# EAGLE board modul_frequency (EAGLE 7.7.0)
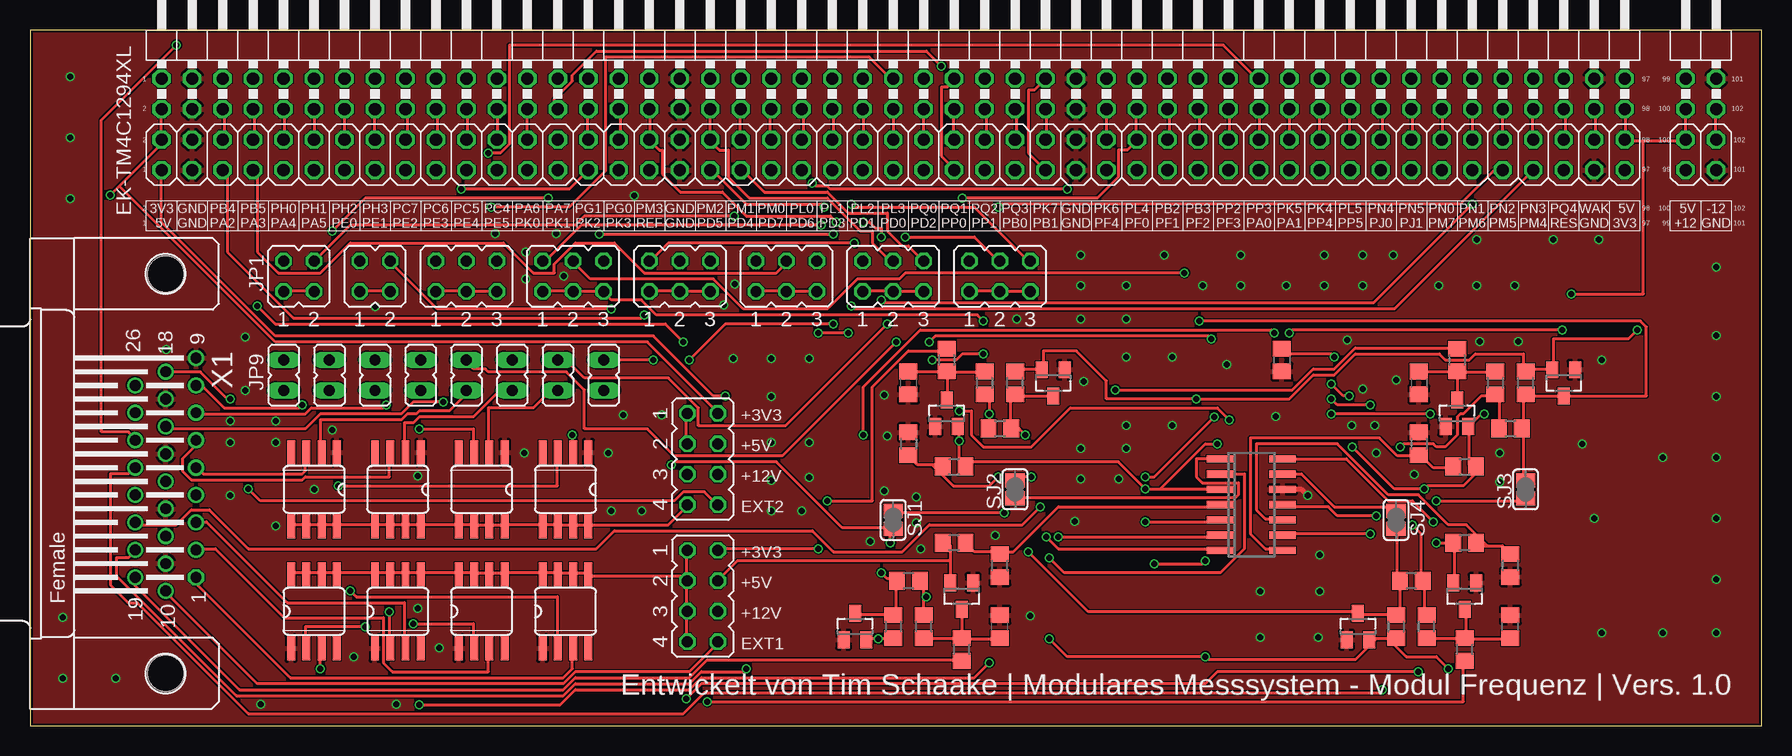
[diagram p5: board, top side]
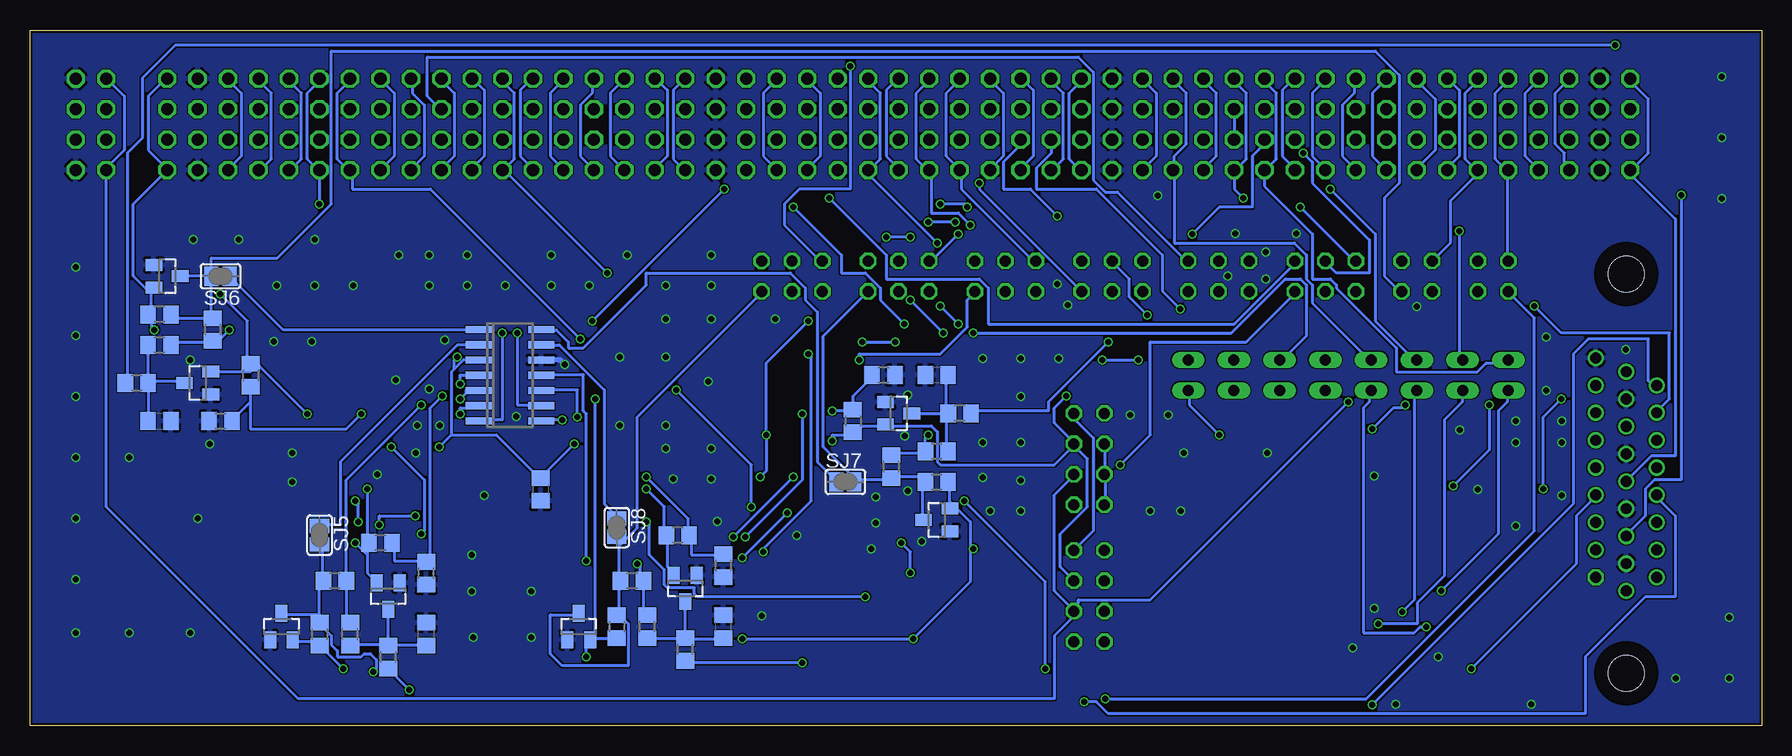
[diagram p6: board, bottom side, seen from below]

Size 144.32 x 58 mm. Coordinates in mm from the lower left corner, seen from the top.
Outline: 0,0 144.32,0 144.32,58 0,58 0,0
Copper layers (1*16): Top 0.018mm / dielectric 1.55mm / Bottom 0.018mm
Design rules "Multi-CB_2L_100µm-Tracks_OL35µm *": minimum track width 0.25mm, minimum drill 0.5mm, track to track 0.1mm, track to pad 0.1mm, pad to pad 0.1mm, via to via 0.1mm, smd to smd 0mil, copper to edge 0.2mm, drill to drill 0.2mm, minimum pad ring 0.125mm, minimum via ring 0.1mm, stop-mask expansion 2mil, vias tented up to drill 0.45mm, thermal gap 0.2mm

## Footprints (pad centres in the part's own frame; a part is rotated, then mirrored left to right if it is on the bottom)
C0805 = smd 1.3 x 1.5: 1 -0.95,0; 2 0.95,0
SOT23 = smd 1 x 1.4: 1 -0.95,-1.1; 2 0.95,-1.1; 3 0,1.1
EK-TM4C1294XL_BB+_NOMARK/90 = drill 1.016 octagon: 1 -60.96,-1.27; 2 -60.96,1.27; 3 -58.42,-1.27; 4 -58.42,1.27; 5 -55.88,-1.27; 6 -55.88,1.27; 7 -53.34,-1.27; 8 -53.34,1.27; 9 -50.8,-1.27; 10 -50.8,1.27; 11 -48.26,-1.27; 12 -48.26,1.27; 13 -45.72,-1.27; 14 -45.72,1.27; 15 -43.18,-1.27; 16 -43.18,1.27; 17 -40.64,-1.27; 18 -40.64,1.27; 19 -38.1,-1.27; 20 -38.1,1.27; 21 -35.56,-1.27; 22 -35.56,1.27; 23 -33.02,-1.27; 24 -33.02,1.27; 25 -30.48,-1.27; 26 -30.48,1.27; 27 -27.94,-1.27; 28 -27.94,1.27; 29 -25.4,-1.27; 30 -25.4,1.27; 31 -22.86,-1.27; 32 -22.86,1.27; 33 -20.32,-1.27; 34 -20.32,1.27; 35 -17.78,-1.27; 36 -17.78,1.27; 37 -15.24,-1.27; 38 -15.24,1.27; 39 -12.7,-1.27; 40 -12.7,1.27; 41 -10.16,-1.27; 42 -10.16,1.27; 43 -7.62,-1.27; 44 -7.62,1.27; 45 -5.08,-1.27; 46 -5.08,1.27; 47 -2.54,-1.27; 48 -2.54,1.27; 49 0,-1.27; 50 0,1.27; 51 2.54,-1.27; 52 2.54,1.27; 53 5.08,-1.27; 54 5.08,1.27; 55 7.62,-1.27; 56 7.62,1.27; 57 10.16,-1.27; 58 10.16,1.27; 59 12.7,-1.27; 60 12.7,1.27; 61 15.24,-1.27; 62 15.24,1.27; 63 17.78,-1.27; 64 17.78,1.27; 65 20.32,-1.27; 66 20.32,1.27; 67 22.86,-1.27; 68 22.86,1.27; 69 25.4,-1.27; 70 25.4,1.27; 71 27.94,-1.27; 72 27.94,1.27; 73 30.48,-1.27; 74 30.48,1.27; 75 33.02,-1.27; 76 33.02,1.27; 77 35.56,-1.27; 78 35.56,1.27; 79 38.1,-1.27; 80 38.1,1.27; 81 40.64,-1.27; 82 40.64,1.27; 83 43.18,-1.27; 84 43.18,1.27; 85 45.72,-1.27; 86 45.72,1.27; 87 48.26,-1.27; 88 48.26,1.27; 89 50.8,-1.27; 90 50.8,1.27; 91 53.34,-1.27; 92 53.34,1.27; 93 55.88,-1.27; 94 55.88,1.27; 95 58.42,-1.27; 96 58.42,1.27; 97 60.96,-1.27; 98 60.96,1.27; 99 66.04,-1.27; 100 66.04,1.27; 101 68.58,-1.27; 102 68.58,1.27
SO14 = smd 0.6 x 2.2: 1 -3.81,-2.6; 2 -2.54,-2.6; 3 -1.27,-2.6; 4 0,-2.6; 5 1.27,-2.6; 6 2.54,-2.6; 7 3.81,-2.6; 8 3.81,2.6; 9 2.54,2.6; 10 1.27,2.6; 11 0,2.6; 12 -1.27,2.6; 13 -2.54,2.6; 14 -3.81,2.6
JP2Q = drill 0.914 octagon: 1 -1.27,-1.27; 2 -1.27,1.27; 3 1.27,-1.27; 4 1.27,1.27
JP3Q = drill 0.914 octagon: 1 -2.54,-1.27; 2 -2.54,1.27; 3 0,-1.27; 4 0,1.27; 5 2.54,-1.27; 6 2.54,1.27
JP1 = drill 0.914 long: 1 0,-1.27; 2 0,1.27
JP4Q = drill 0.914 octagon: 1 -3.81,-1.27; 2 -3.81,1.27; 3 -1.27,-1.27; 4 -1.27,1.27; 5 1.27,-1.27; 6 1.27,1.27; 7 3.81,-1.27; 8 3.81,1.27
EK-TM4C1294XL_BB+ = drill 1.016 octagon: 1 -60.96,-1.27; 2 -60.96,1.27; 3 -58.42,-1.27; 4 -58.42,1.27; 5 -55.88,-1.27; 6 -55.88,1.27; 7 -53.34,-1.27; 8 -53.34,1.27; 9 -50.8,-1.27; 10 -50.8,1.27; 11 -48.26,-1.27; 12 -48.26,1.27; 13 -45.72,-1.27; 14 -45.72,1.27; 15 -43.18,-1.27; 16 -43.18,1.27; 17 -40.64,-1.27; 18 -40.64,1.27; 19 -38.1,-1.27; 20 -38.1,1.27; 21 -35.56,-1.27; 22 -35.56,1.27; 23 -33.02,-1.27; 24 -33.02,1.27; 25 -30.48,-1.27; 26 -30.48,1.27; 27 -27.94,-1.27; 28 -27.94,1.27; 29 -25.4,-1.27; 30 -25.4,1.27; 31 -22.86,-1.27; 32 -22.86,1.27; 33 -20.32,-1.27; 34 -20.32,1.27; 35 -17.78,-1.27; 36 -17.78,1.27; 37 -15.24,-1.27; 38 -15.24,1.27; 39 -12.7,-1.27; 40 -12.7,1.27; 41 -10.16,-1.27; 42 -10.16,1.27; 43 -7.62,-1.27; 44 -7.62,1.27; 45 -5.08,-1.27; 46 -5.08,1.27; 47 -2.54,-1.27; 48 -2.54,1.27; 49 0,-1.27; 50 0,1.27; 51 2.54,-1.27; 52 2.54,1.27; 53 5.08,-1.27; 54 5.08,1.27; 55 7.62,-1.27; 56 7.62,1.27; 57 10.16,-1.27; 58 10.16,1.27; 59 12.7,-1.27; 60 12.7,1.27; 61 15.24,-1.27; 62 15.24,1.27; 63 17.78,-1.27; 64 17.78,1.27; 65 20.32,-1.27; 66 20.32,1.27; 67 22.86,-1.27; 68 22.86,1.27; 69 25.4,-1.27; 70 25.4,1.27; 71 27.94,-1.27; 72 27.94,1.27; 73 30.48,-1.27; 74 30.48,1.27; 75 33.02,-1.27; 76 33.02,1.27; 77 35.56,-1.27; 78 35.56,1.27; 79 38.1,-1.27; 80 38.1,1.27; 81 40.64,-1.27; 82 40.64,1.27; 83 43.18,-1.27; 84 43.18,1.27; 85 45.72,-1.27; 86 45.72,1.27; 87 48.26,-1.27; 88 48.26,1.27; 89 50.8,-1.27; 90 50.8,1.27; 91 53.34,-1.27; 92 53.34,1.27; 93 55.88,-1.27; 94 55.88,1.27; 95 58.42,-1.27; 96 58.42,1.27; 97 60.96,-1.27; 98 60.96,1.27; 99 66.04,-1.27; 100 66.04,1.27; 101 68.58,-1.27; 102 68.58,1.27
R0805 = smd 1.3 x 1.5: 1 -0.95,0; 2 0.95,0
SJ = smd 1.168 x 1.6: 1 -0.762,0; 2 0.762,0
SO08 = smd 0.66 x 2.032: 1 -1.905,-3.073; 2 -0.635,-3.073; 3 0.635,-3.073; 4 1.905,-3.073; 5 1.905,3.073; 6 0.635,3.073; 7 -0.635,3.073; 8 -1.905,3.073
HDF26H = drill 0.9 octagon: 1 8.639,2.54 | drill 0.9: 2 6.353,2.54; 3 4.067,2.54; 4 1.781,2.54; 5 -0.505,2.54; 6 -2.791,2.54; 7 -5.077,2.54; 8 -7.363,2.54; 9 -9.649,2.54; 10 9.782,0; 11 7.496,0; 12 5.21,0; 13 2.924,0; 14 0.638,0; 15 -1.648,0; 16 -3.934,0; 17 -6.22,0; 18 -8.506,0; 19 8.639,-2.54; 20 6.353,-2.54; 21 4.067,-2.54; 22 1.781,-2.54; 23 -0.505,-2.54; 24 -2.791,-2.54; 25 -5.077,-2.54; 26 -7.363,-2.54 | hole 3: -16.65,0; 16.65,0

## Placement (x,y rotation side)
C1  10p  [C0805]  73.2,28.57 270 top
C2  10p  [C0805]  115.75,28.57 270 top
C3  10p  [C0805]  123.37,8.26 90 top
C4  10p  [C0805]  80.82,8.26 90 top
C5  100n  [C0805]  104.31,30.48 270 top
C6  10p  [C0805]  111.3,7.62 90 bottom
C7  10p  [C0805]  133.53,25.4 0 bottom
C8  10p  [C0805]  68.75,29.21 180 bottom
C9  10p  [C0805]  86.53,8.26 90 bottom
C10  100n  [C0805]  101.78,19.68 270 bottom
D1  BAT54S  [SOT23]  85.27,28.57 180 top
D2  BAT54S  [SOT23]  76.38,26.04 0 top
D3  BAT54S  [SOT23]  127.81,28.57 180 top
D4  BAT54S  [SOT23]  118.92,26.04 0 top
D5  BAT54S  [SOT23]  110.67,8.26 0 top
D6  BAT54S  [SOT23]  119.56,10.79 180 top
D7  BAT54S  [SOT23]  68.75,8.26 0 top
D8  BAT54S  [SOT23]  77.64,10.79 180 top
D9  BAT54S  [SOT23]  123.37,8.26 0 bottom
D10  BAT54S  [SOT23]  114.48,10.79 180 bottom
D11  BAT54S  [SOT23]  132.89,37.47 270 bottom
D12  BAT54S  [SOT23]  130.35,28.57 90 bottom
D13  BAT54S  [SOT23]  68.75,17.14 90 bottom
D14  BAT54S  [SOT23]  71.93,26.04 270 bottom
D15  BAT54S  [SOT23]  98.6,8.26 0 bottom
D16  BAT54S  [SOT23]  89.71,11.43 180 bottom
EK-TM4C1294XL  EK-TM4C1294XL_BB+_NOMARK/90  [EK-TM4C1294XL_BB+_NOMARK/90]  71.93,52.67 0 top
IC1  LM339D  [SO14]  101.78,18.41 270 top
IC2  LM339D  [SO14]  104.31,29.21 270 bottom
JP1  [JP2Q]  22.4,37.47 0 top
JP2  [JP2Q]  28.75,37.47 0 top
JP3  [JP3Q]  36.37,37.47 0 top
JP4  [JP3Q]  45.26,37.47 0 top
JP5  [JP3Q]  54.15,37.47 0 top
JP6  [JP3Q]  63.04,37.47 0 top
JP7  [JP3Q]  71.93,37.47 0 top
JP8  [JP3Q]  80.82,37.47 0 top
JP9  [JP1]  21.13,29.21 0 top
JP10  [JP1]  24.94,29.21 0 top
JP11  [JP1]  28.75,29.21 0 top
JP12  [JP1]  32.56,29.21 0 top
JP13  [JP1]  36.37,29.21 0 top
JP14  [JP1]  40.18,29.21 0 top
JP15  [JP1]  43.99,29.21 0 top
JP16  [JP1]  47.8,29.21 0 top
JP17  [JP4Q]  56.05,10.79 270 top
JP18  [JP4Q]  56.05,22.23 270 top
JP_EK-TM4C1294XL  EK-TM4C1294XL_BB+  [EK-TM4C1294XL_BB+]  71.93,47.59 0 top
R1  15k915  [R0805]  76.38,30.48 270 top
R2  271k666  [R0805]  80.82,24.77 0 top
R3  23k952  [R0805]  77.01,21.59 0 top
R4  10k  [R0805]  73.2,23.5 270 top
R5  84k085  [R0805]  79.55,28.57 270 top
R6  10k  [R0805]  82.09,28.57 90 top
R7  15k915  [R0805]  118.92,30.48 270 top
R8  271k666  [R0805]  123.37,24.77 0 top
R9  23k952  [R0805]  119.56,21.59 0 top
R10  10k  [R0805]  115.75,23.5 270 top
R11  84k085  [R0805]  122.09,28.57 270 top
R12  10k  [R0805]  124.64,28.57 90 top
R13  15k915  [R0805]  119.56,6.35 90 top
R14  271k666  [R0805]  115.11,12.06 180 top
R15  23k952  [R0805]  119.56,15.24 180 top
R16  10k  [R0805]  123.37,13.34 90 top
R17  84k085  [R0805]  116.38,8.26 90 top
R18  10k  [R0805]  113.84,8.26 270 top
R19  15k915  [R0805]  77.64,6.35 90 top
R20  271k666  [R0805]  73.2,12.06 180 top
R21  23k952  [R0805]  77.01,15.24 180 top
R22  10k  [R0805]  80.82,13.34 90 top
R23  84k085  [R0805]  74.47,8.26 90 top
R24  10k  [R0805]  71.93,8.26 270 top
R25  15k915  [R0805]  114.48,5.71 90 bottom
R26  271k666  [R0805]  118.92,12.06 180 bottom
R27  23k952  [R0805]  115.11,15.24 180 bottom
R28  10k  [R0805]  111.3,12.7 90 bottom
R29  84k085  [R0805]  117.65,7.62 90 bottom
R30  10k  [R0805]  120.19,7.62 270 bottom
R31  15k915  [R0805]  135.43,28.57 0 bottom
R32  271k666  [R0805]  129.08,33.02 90 bottom
R33  23k952  [R0805]  125.91,29.21 90 bottom
R34  10k  [R0805]  128.44,25.4 0 bottom
R35  84k085  [R0805]  133.53,31.75 0 bottom
R36  10k  [R0805]  133.53,34.29 180 bottom
R37  15k915  [R0805]  66.85,26.04 180 bottom
R38  271k666  [R0805]  72.56,21.59 270 bottom
R39  23k952  [R0805]  75.74,25.4 270 bottom
R40  10k  [R0805]  73.2,29.21 180 bottom
R41  84k085  [R0805]  68.75,22.86 180 bottom
R42  10k  [R0805]  68.75,20.32 0 bottom
R43  15k915  [R0805]  89.71,6.35 90 bottom
R44  271k666  [R0805]  94.16,12.06 180 bottom
R45  23k952  [R0805]  90.34,15.88 180 bottom
R46  10k  [R0805]  86.53,13.34 90 bottom
R47  84k085  [R0805]  92.89,8.26 90 bottom
R48  10k  [R0805]  95.42,8.26 270 bottom
SJ1  [SJ]  71.93,17.14 270 top
SJ2  [SJ]  82.09,19.68 90 top
SJ3  [SJ]  124.64,19.68 90 top
SJ4  [SJ]  113.84,17.14 270 top
SJ5  [SJ]  120.19,15.88 270 bottom
SJ6  [SJ]  128.44,37.47 180 bottom
SJ7  [SJ]  76.38,20.32 0 bottom
SJ8  [SJ]  95.42,16.51 270 bottom
U$1  ISP74IR_D  [SO08]  44.62,9.53 0 top
U$2  ISP74IR_D  [SO08]  37.64,9.53 0 top
U$3  ISP74IR_D  [SO08]  30.65,9.53 0 top
U$4  ISP74IR_D  [SO08]  23.67,9.53 0 top
U$5  ISP74IR_D  [SO08]  23.67,19.68 180 top
U$6  ISP74IR_D  [SO08]  30.65,19.68 180 top
U$7  ISP74IR_D  [SO08]  37.64,19.68 180 top
U$8  ISP74IR_D  [SO08]  44.62,19.68 180 top
X1  [HDF26H]  11.3,21 270 top

## Tracks (layer width: path | path; a pad name or v marks a point on that pad's centre or on a via)
+3V3  (via drill 0.5)
  Top 0.25: 7.45,45 11.2,48.75 JP_EK-TM4C1294XL.2 10.95,49 10.95,51.25 EK-TM4C1294XL.1 | 7.45,45 v6.7,44.25 | v133.95,33 133.2,32.25 126.95,32.25 126.95,29.75 D3.2 126.7,29.75 124.7,29.75 R12.2 124.45,29.75 124.45,31 120.45,31 119.95,30.5 117.95,30.5 117.45,31 110.45,31 108.7,29.25 106.95,29.25 104.95,27.25 v97.2,27.25 89.7,27.25 89.7,28.75 87.2,31.25 84.45,31.25 84.45,29.75 D1.2 84.2,29.75 82.2,29.75 R6.2 | D7.2 69.95,7.25 v70.7,7.25 71.7,7.25 R24.2 | v65.7,14.75 57.45,14.75 JP17.2 | 113.2,7.25 113.7,7.25 R18.2 113.2,7.25 | 113.2,7.25 112.2,7.25 | 112.2,7.25 111.7,7.25 D5.2 | 112.2,7.25 110.45,5.5 98.2,5.5 v97.95,5.75 86.45,5.75 v84.95,7.25 | v118.2,4.75 117.2,5.75 114.7,5.75 113.2,7.25 | 7.45,45 20.45,32 51.45,32 57.2,26.25 JP18.2
  Bottom 0.25: v6.7,44.25 6.7,20.5 8.95,20.5 9.7,19.75 9.7,17.5 11.2,16 X1.12 | EK-TM4C1294XL.98 132.95,54 134.45,52.5 134.45,48 132.95,46.5 JP_EK-TM4C1294XL.97 132.95,46.25 135.7,43.5 135.7,37.5 134.2,36 | 134.2,34.75 134.2,36 | 134.2,36 134.2,36.5 D11.2 | 134.2,34.75 134.45,34.5 R36.2 134.2,34.75 | v133.95,33 134.2,33.25 134.2,34.75 | JP17.2 57.2,14.75 55.7,16.25 55.7,24 57.2,25.5 57.2,26 JP18.2 | 67.7,18.75 67.7,20.25 R42.2 | 67.7,18.75 67.7,18.25 D13.2 | 65.95,14.75 65.95,17 67.7,18.75 | 65.95,14.75 65.95,12 v70.7,7.25 v84.95,7.25 | 65.95,14.75 v65.7,14.75 | D9.2 122.2,7 120.2,7 120.2,6.75 R30.2 119.95,6.5 v118.2,4.75 | 97.2,7.25 95.45,7.25 R48.2 | 97.2,7.25 97.45,7.25 D15.2 | v97.95,5.75 97.95,6.75 97.7,7 D15.2 | 97.2,7.25 v97.2,27.25 | 97.2,7.25 D15.2
D0  (via drill 0.5)
  Top 0.25: v26.7,11.25 27.2,10.75 43.95,10.75 43.95,6.5 U$1.2
  Bottom 0.25: v26.7,11.25 21.95,16 21.95,26.25 21.2,27 21.2,27.75 JP9.1
D1  (via drill 0.5)
  Top 0.25: v31.95,8.5 36.95,8.5 36.95,6.5 U$2.2
  Bottom 0.25: v31.95,8.5 28.7,8.5 28.7,10.25 26.45,12.5 26.45,25.5 24.95,27 24.95,27.75 JP10.1
D2  (via drill 0.5)
  Top 0.25: v29.95,9.5 29.95,6.5 U$3.2
  Bottom 0.25: v29.95,9.5 28.95,10.5 28.95,27.75 JP11.1
D3  (via drill 0.5)
  Top 0.25: v27.95,8.25 22.95,8.25 22.95,6.5 U$4.2
  Bottom 0.25: v27.95,8.25 28.45,8.25 28.95,7.75 33.2,7.75 33.2,26.5 32.7,27 32.7,27.75 JP12.1
D4
  Top 0.25: U$5.2 24.2,23 24.2,25.5 30.95,25.5 31.45,26 32.2,26 32.45,26.25 34.95,26.25 36.45,27.75 JP13.1
D5
  Top 0.25: U$6.2 31.2,23 31.2,25.25 31.95,25.25 32.45,25.75 36.95,25.75 38.95,27.75 39.95,27.75 JP14.1
D6
  Top 0.25: U$7.2 38.2,23 38.2,26.5 41.95,26.5 43.2,27.75 43.95,27.75 JP15.1
D7  (via drill 0.5)
  Top 0.25: v45.2,24.25 45.2,23 U$8.2
  Bottom 0.25: v45.2,24.25 47.7,26.75 47.7,27.75 JP16.1
F_+5V  (via drill 0.5)
  Top 0.25: v108.7,30.75 108.45,31 104.7,31 104.45,31.25 C5.1 | EK-TM4C1294XL.97 132.95,51.25 132.95,49 JP_EK-TM4C1294XL.98 132.95,48.75 134.45,48.75 | EK-TM4C1294XL.99 137.95,51.25 137.95,49 JP_EK-TM4C1294XL.100 137.95,48.75 134.45,48.75 | D6.2 118.7,12 118.7,15 R15.2 118.45,15.25 v117.2,15.25 | v121.2,26 120.95,26 119.95,25 D4.2 119.95,24.75 119.95,21.75 120.45,21.75 R9.2 120.45,21.5 120.45,21 119.45,20 116.45,20 v116.2,19.75 113.7,19.75 v110.2,23.25 | 134.45,48.75 134.45,36 v128.45,36 | 76.7,13.75 76.7,15 76.2,15 R21.2 | 76.7,13.75 76.7,12 D8.2 | 76.7,13.75 58.95,13.75 57.45,12.25 JP17.4 | D2.2 77.45,24.75 v77.45,23.75 77.45,21.75 77.95,21.75 R3.2 78.2,21.75 78.45,22 90.7,22 v92.95,19.75 94.2,19.75 | 94.2,19.75 98.95,19.75 IC1.3 | v57.95,27.5 56.95,27.5 51.95,32.5 20.45,32.5 10.95,42 10.95,46.25 JP_EK-TM4C1294XL.1 | v98.95,23.5 97.95,23.5 94.2,19.75
  Bottom 0.25: 109.2,24.25 105.45,24.25 101.95,20.75 C10.1 101.7,20.75 v98.95,23.5 | 109.2,24.25 109.2,29.5 108.95,29.75 | 108.95,29.75 108.2,30.5 106.95,30.5 IC2.3 | v108.7,30.75 108.95,30.5 108.95,29.75 | 116.2,14.25 116.2,15 R27.2 116.2,15.25 v116.2,19.75 | 116.2,14.25 116.2,12.75 115.45,12 D10.2 | 116.2,14.25 v117.2,15.25 | 126.2,29.5 125.95,29.5 125.95,30 R33.2 125.7,30 125.2,30 v121.2,26 | 126.2,29.5 129.2,29.5 D12.2 | v128.45,36 126.2,33.75 126.2,29.5 | v110.2,23.25 109.2,24.25 | 10.95,46.25 10.95,46 7.2,42.25 7.2,22.5 9.2,22.5 11.2,20.5 X1.14 | 10.95,46.25 9.45,47.75 9.45,52.25 10.95,53.75 EK-TM4C1294XL.2 | 10.95,46.25 JP_EK-TM4C1294XL.1 | JP18.4 57.2,23.25 56.2,22.25 56.2,18.25 58.45,16 58.45,13.25 57.45,12.25 JP17.4 | v77.45,23.75 77.45,24.25 75.95,24.25 R39.2 75.7,24.5 75.7,25 73.2,25 D14.2 72.95,25 69.2,25 68.7,24.5 68.7,22 68.45,21.75 58.95,21.75 57.45,23.25 JP18.4 | D16.2 90.7,12.75 91.2,13.25 91.2,15.75 R45.2 91.45,16 91.45,18.25 v92.95,19.75 | v57.95,27.5 58.95,26.5 58.95,25.25 57.45,23.75 57.45,23.5 JP18.4
F_+12V  (via drill 0.5)
  Top 0.25: v34.45,27 31.95,27 30.95,26 24.2,26 22.95,24.75 11.45,24.75 X1.16
  Bottom 0.25: EK-TM4C1294XL.100 137.95,54 136.45,52.5 136.45,48 137.95,46.5 JP_EK-TM4C1294XL.99 137.95,46.25 137.95,18.25 121.95,2.25 58.95,2.25 58.95,7.5 57.45,9 57.45,9.5 JP17.6 | v34.45,27 50.95,10.5 56.95,10.5 56.95,10.25 57.2,10 57.2,9.75 JP17.6 | JP18.6 57.45,20.75 58.95,19.25 58.95,11.25 57.45,9.75 JP17.6
F_-12V
  Top 0.25: JP_EK-TM4C1294XL.102 140.45,49 140.45,51.25 EK-TM4C1294XL.101
GND  (via drill 0.5)
  Top 0.406: v106.47,19.18 105.97,19.68 IC1.12
  Bottom 0.406: v99.74,30.1 100.12,30.48 IC2.12
  other vias: 11.35,31.37 25.19,24.64 41.2,22.73 129.33,23.5 113.84,28.83 103.81,25.78 48.18,22.73 26.97,5.71 34.08,6.48 70.03,15.37 71.42,24.13 71.17,19.56 73.84,16.89 73.84,19.05 58.59,30.61 61.77,30.61 64.94,30.61 61.77,27.43 61.77,23.62 64.94,23.62 61.77,20.45 61.77,17.91 64.31,17.91 50.97,17.91 48.44,17.91 16.68,23.62 16.68,19.18 20.49,23.62 20.49,16.64 49.45,25.91 52.63,25.91 111.05,36.7 107.87,36.7 104.7,36.7 100.89,36.7 97.71,36.7 91.36,36.7 87.55,36.7 87.55,39.24 94.54,39.24 100.89,39.24 107.87,39.24 111.05,39.24 117.4,36.7 120.57,36.7 123.75,36.7 126.92,40.51 130.73,40.51 120.57,40.51 113.59,39.24 91.36,33.91 87.55,33.91 82.22,33.91 91.36,30.73 95.17,30.73 95.17,25.02 91.36,25.02 87.55,23.11 91.36,23.11 87.55,20.57 90.73,20.57 130.98,30.48 124,32 120.83,32 109.78,32.13 122.48,22.73 122.48,20.32 115.36,20.95 112.19,22.73 112.06,25.02 110.16,25.02 111.05,28.07 19.23,1.78 30.53,1.78 32.31,9.78 23.67,19.68 32.31,20.83 20.49,25.4 16.68,25.4 17.95,32.38 17.95,27.94 28.75,34.92 44.5,37.47 87.81,28.7 83.36,9.14 58.72,36.83 57.83,35.05 50.34,44.2 43.86,41.02 38.78,41.02 41.32,37.21 41.32,39.5 64.94,20.7 87.04,17.02 80.44,15.88 74.22,14.73 71.17,27.56 107.36,7.37 102.54,7.37 102.54,11.18 107.49,11.18 107.49,14.22 3.35,54.1 3.35,49.02 3.35,43.94 2.71,3.94 2.71,9.02 7.16,3.94 140.51,38.23 140.51,32.51 140.51,27.43 140.51,22.35 140.51,17.27 140.51,12.19 140.51,7.75 136.06,7.75 130.98,7.75 130.35,17.27 136.06,22.35
  pour Bottom: 0,58 144.32,58 144.32,0 0,0
  pour Top: 0,58 144.32,58 144.32,0 0,0
IN0
  Top 0.25: R19.1 77.45,5.5 56.45,5.5 54.95,4 45.45,4 44.45,3 17.45,3 8.7,11.75 8.7,12.25 X1.19
IN1  (via drill 0.5)
  Top 0.25: v66.45,18.75 70.2,18.75 70.2,28.25 73.2,31.25 76.2,31.25 R1.1 | v59.7,4.75 59.45,4.5 55.95,4.5 54.95,3.5 45.45,3.5 44.45,2.5 17.2,2.5 7.2,12.5 7.2,14 8.2,14 8.7,14.5 X1.20
  Bottom 0.25: v66.45,18.75 59.7,12 v59.7,4.75
IN2  (via drill 0.5)
  Top 0.25: v90.45,28 105.2,28 106.95,29.75 108.7,29.75 110.45,31.5 118.7,31.5 R7.1 | v84.2,18.25 82.7,16.75 74.95,16.75 72.7,14.5 66.95,14.5 65.2,16.25 48.7,16.25 47.2,14.75 18.2,14.75 14.95,18 13.45,18 12.2,16.75 8.95,16.75 X1.21
  Bottom 0.25: v90.45,28 84.2,21.75 v84.2,18.25
IN3  (via drill 0.5)
  Top 0.25: v56.45,2 119.45,2 119.45,5.25 R13.1
  Bottom 0.25: v56.45,2 55.45,2 54.45,1 14.7,1 14.7,5.75 9.7,10.75 7.2,10.75 7.2,17.5 8.7,19 X1.22
IN4  (via drill 0.5)
  Top 0.25: v112.7,3 112.45,2.75 56.2,2.75 54.45,1 18.2,1 8.95,10.25 8.2,10.25 6.7,11.75 6.7,21 8.2,21 8.7,21.5 X1.23
  Bottom 0.25: v112.7,3 114.45,4.75 R25.1
IN5  (via drill 0.5)
  Top 0.25: v12.2,56.75 5.95,50.5 5.95,24.5 8.2,24.5 8.7,24 X1.24
  Bottom 0.25: v12.2,56.75 132.2,56.75 134.95,54 134.95,49 136.2,47.75 136.2,28.75 R31.1
IN6  (via drill 0.5)
  Top 0.25: v54.45,32 52.95,33.5 20.45,33.5 v18.95,35
  Bottom 0.25: v54.45,32 59.45,27 59.45,26.25 65.7,26.25 R37.1 | v18.95,35 16.7,32.75 7.7,32.75 7.7,27.25 8.7,26.25 X1.25
IN7  (via drill 0.5)
  Top 0.25: v79.95,5.25 78.7,4 55.95,4 54.95,3 45.45,3 44.2,1.75 v32.45,1.75
  Bottom 0.25: v79.95,5.25 89.7,5.25 R43.1 | v32.45,1.75 15.7,18.5 15.7,31 14.45,32.25 9.45,32.25 9.45,28.75 8.95,28.25 X1.26
N$1  (via drill 0.5)
  Top 0.25: v81.2,17.75 71.95,17.75 SJ1.1 | v84.95,14 86.2,12.75 99.2,12.75 101.2,14.75 101.2,21 99.2,21 IC1.2
  Bottom 0.25: v84.95,14 v81.2,17.75
N$2  (via drill 0.5)
  Top 0.25: v108.45,27.25 108.95,26.75 v111.7,26.75
  Bottom 0.25: R29.2 117.7,8.75 117.95,9 117.95,12 R26.1 117.95,12.25 117.95,20.5 v111.7,26.75 | v108.45,27.25 107.95,27.75 107.95,28 106.95,28 IC2.5
N$3  (via drill 0.5)
  Top 0.25: R2.1 79.95,25 v79.95,26 79.95,27.5 79.7,27.5 R5.2 | v84.7,15.75 85.7,14.75 98.95,14.75 IC1.7
  Bottom 0.25: v84.7,15.75 79.95,20.5 v79.95,26
N$4  (via drill 0.5)
  Top 0.25: 75.2,21.75 75.95,21.75 R3.1 | 75.2,21.75 73.95,21.75 73.2,22.5 R4.2 | v85.7,15.75 98.95,15.75 IC1.6 | v80.7,20.75 79.95,20 76.95,20 75.2,21.75
  Bottom 0.25: v80.7,20.75 v85.7,15.75
N$5
  Top 0.25: 76.45,29.5 76.45,27.25 D2.3 | C1.1 73.2,29.5 76.2,29.5 R1.2 76.45,29.5 | 76.45,29.5 79.45,29.5 R5.1
N$6
  Top 0.25: SJ2.1 82.2,19 100.45,19 100.7,19.25 100.7,20.25 97.7,20.25 97.2,20.75 97.2,22.25 98.95,22.25 IC1.1
N$7  (via drill 0.5)
  Top 0.25: R8.1 122.45,25 122.45,27.5 122.2,27.5 R11.2 121.95,27.5 120.95,27.5 119.45,26 119.2,26 118.95,25.75 118.95,24.25 117.95,23.25 117.2,23.25 116.95,23.5 114.45,23.5 v114.2,23.25 | v111.7,16 104.45,16 IC1.9
  Bottom 0.25: v111.7,16 111.45,16.25 111.45,20.5 v114.2,23.25
N$8
  Top 0.25: R9.1 118.45,21.5 116.95,21.5 115.95,22.5 R10.2 115.7,22.5 113.95,22.5 112.45,24 101.7,24 101.7,16 102.95,14.75 104.2,14.75 IC1.8
N$9
  Top 0.25: 118.95,29.5 118.95,27.25 D4.3 | C2.1 115.95,29.5 118.7,29.5 R7.2 118.95,29.5 | 118.95,29.5 121.95,29.5 R11.1
N$10  (via drill 0.5)
  Top 0.25: 74.45,10.75 74.45,12 74.2,12 R20.1 | 74.45,10.75 74.45,9.25 R23.2 | v92.95,17 98.95,17 IC1.5 | 74.45,10.75 v74.7,10.75
  Bottom 0.25: v92.95,17 92.7,16.75 92.7,14.25 91.45,13 91.45,11.75 91.2,11.5 88.95,11.5 88.95,11 88.7,10.75 v74.7,10.75
N$11
  Top 0.25: R21.1 78.7,14.5 80.7,14.5 R22.2 80.95,14.5 81.95,14.5 85.7,18.25 98.95,18.25 IC1.4
N$12
  Top 0.25: D8.3 77.7,9.5 77.7,7.5 R19.2 | R23.1 74.7,7.25 77.45,7.25 R19.2 | C4.1 80.7,7.25 77.7,7.25 R19.2
N$13  (via drill 0.5)
  Top 0.25: v117.2,18.75 124.45,18.75 SJ3.1 | v116.95,17 115.2,18.75 113.2,18.75 109.7,22.25 104.45,22.25 IC1.14
  Bottom 0.25: v117.2,18.75 116.95,18.5 v116.95,17
N$14  (via drill 0.5)
  Top 0.25: R17.2 116.2,9.25 116.2,12 R14.1 115.95,12.25 115.95,16 v115.2,16.75 | v112.2,17.5 108.95,17.5 108.2,18.25 104.45,18.25 IC1.11
  Bottom 0.25: v112.2,17.5 115.2,17.5 v115.2,16.75
N$15
  Top 0.25: 121.45,15 120.7,15 R15.1 | 121.45,15 122.7,15 123.2,14.5 R16.2 | 121.45,15 119.7,16.75 118.2,16.75 115.7,19.25 113.2,19.25 108.95,23.5 102.2,23.5 102.2,18 102.95,17.25 104.2,17.25 IC1.10
N$16
  Top 0.25: D6.3 119.7,9.5 119.7,7.5 R13.2 | R17.1 116.45,7.25 119.45,7.25 R13.2 | C3.1 123.2,7.25 119.7,7.25 R13.2
N$17
  Top 0.25: SJ4.1 113.7,18 113.45,18.25 108.7,18.25 105.95,21 104.45,21 IC1.13
N$18  (via drill 0.5)
  Top 0.25: v108.45,28.5 109.45,27.5 v109.95,27.5
  Bottom 0.25: R27.1 113.95,15 113.95,13.75 111.45,13.75 R28.2 110.95,14 110.95,26.5 v109.95,27.5 | v108.45,28.5 108.45,29.25 106.95,29.25 IC2.4
N$19
  Bottom 0.25: 114.45,6.75 114.45,9.5 D10.3 | 114.45,6.75 111.45,6.75 C6.1 | 114.45,6.75 R25.2 114.7,6.75 117.45,6.75 R29.1
N$20  (via drill 0.5)
  Top 0.25: v104.95,32.75 105.2,33 v127.7,33
  Bottom 0.25: R35.2 132.45,31.75 132.45,32 129.2,32 R32.1 128.95,32.25 128.45,32.25 v127.7,33 | v104.95,32.75 104.95,25.5 106.7,25.5 IC2.7
N$21  (via drill 0.5)
  Top 0.25: v116.7,26 v108.45,26
  Bottom 0.25: 125.95,27 127.45,25.5 R34.2 | 125.95,27 125.95,28.25 R33.1 | v108.45,26 108.45,26.5 106.95,26.5 IC2.6 | v116.7,26 117.95,24.75 125.95,24.75 125.95,27
N$22
  Bottom 0.25: 134.45,28.75 131.45,28.75 D12.3 | C7.1 134.45,25.5 134.45,28.5 R31.2 134.45,28.75 | 134.45,28.75 134.45,31.75 R35.1
N$23
  Bottom 0.25: SJ6.1 127.45,37.25 123.2,33 106.95,33 IC2.1
N$24  (via drill 0.5)
  Top 0.25: v103.7,32.75 103.45,33 74.2,33 69.45,28.25 v69.45,24.25
  Bottom 0.25: R38.1 72.45,22.75 69.95,22.75 R41.2 69.7,23 69.7,24 v69.45,24.25 | v103.7,32.75 103.7,26.75 101.95,26.75 IC2.9
N$25  (via drill 0.5)
  Top 0.25: v99.95,25.5 98.95,26.5 86.7,26.5 83.45,23.25 79.45,23.25 78.45,24.25 78.45,26.25 v77.45,26.25
  Bottom 0.25: R40.2 74.2,29 75.7,27.5 75.7,26.5 R39.1 75.95,26.25 v77.45,26.25 | v99.95,25.5 101.7,25.5 IC2.8
N$26
  Bottom 0.25: 67.95,26 70.7,26 D14.3 | 67.95,26 67.95,23 R41.1 | 67.95,26 R37.2 67.95,26.25 67.95,29 C8.1
N$27
  Bottom 0.25: SJ7.1 77.2,20.5 78.7,22 78.7,34.5 79.7,35.5 79.7,36.5 80.95,37.75 92.95,37.75 92.95,36.75 98.2,31.5 99.45,31.5 99.45,32 100.45,33 101.7,33 IC2.14
N$28  (via drill 0.5)
  Top 0.25: v97.95,13.75 97.7,13.5 v93.7,13.5
  Bottom 0.25: R47.2 92.95,9.25 93.2,9.5 93.2,12 R44.1 93.45,12.25 93.45,13.25 v93.7,13.5 | v97.95,13.75 97.95,26 98.2,26.25 98.2,29.25 101.7,29.25 IC2.11
N$29  (via drill 0.5)
  Top 0.25: v98.7,25.75 93.7,20.75 v92.95,20.75
  Bottom 0.25: R46.2 86.7,14.25 89.2,14.25 89.2,15.75 R45.1 89.45,16 89.45,17.25 v92.95,20.75 | v98.7,25.75 98.7,28 101.7,28 IC2.10
N$30
  Bottom 0.25: D16.3 89.7,10.25 89.7,7.5 R43.2 | C9.1 86.7,7.25 89.7,7.25 R43.2 | R47.1 92.7,7.25 89.95,7.25 R43.2
N$31
  Bottom 0.25: IC2.13 100.2,31.75 96.45,28 96.45,18.5 95.45,17.5 SJ8.1
N$32
  Bottom 0.25: IC2.2 108.7,31.75 118.45,22 118.45,16.75 119.95,16.75 SJ5.1
OUT0
  Top 0.25: U$1.3 45.2,6.25 45.2,4.75 44.45,4 21.7,4 13.95,11.75 13.95,12.25 X1.1
OUT1
  Top 0.25: U$2.3 38.2,6.25 38.2,4.5 30.2,4.5 29.45,5.25 29.45,9 21.2,9 15.45,14.75 13.95,14.75 X1.2
OUT2
  Top 0.25: U$3.3 31.2,6.5 31.2,10.25 21.45,10.25 14.7,17 13.95,17 X1.3
OUT3  (via drill 0.5)
  Top 0.25: v24.2,4.75 24.2,6.25 U$4.3
  Bottom 0.25: v24.2,4.75 15.45,13.5 15.45,17.5 13.95,19 X1.4
OUT4
  Top 0.25: U$5.3 22.95,22.75 22.95,21.25 22.7,21 14.45,21 13.95,21.5 X1.5
OUT5
  Top 0.25: U$6.3 29.95,22.75 29.95,20.75 22.95,20.75 22.7,20.5 13.45,20.5 12.7,21.25 12.7,22.25 13.7,23.25 13.7,23.75 X1.6
OUT6  (via drill 0.5)
  Top 0.25: v32.45,24.75 36.95,24.75 36.95,23 U$7.3 | v29.7,26.75 29.45,26.5 23.45,26.5 22.95,26 13.95,26 X1.7
  Bottom 0.25: v32.45,24.75 30.7,26.5 29.7,26.5 v29.7,26.75
OUT7  (via drill 0.5)
  Top 0.25: v25.7,20 43.95,20 43.95,22.75 U$8.3 | v22.7,26.75 22.45,26.5 16.2,26.5 14.45,28.25 13.95,28.25 X1.8
  Bottom 0.25: v25.7,20 22.7,23 v22.7,26.75
PA0  (via drill 0.5)
  Top 0.25: v38.2,47.75 39.2,47.75 39.95,48.5 39.95,56.75 99.45,56.75 102.2,54 EK-TM4C1294XL.74
  Bottom 0.25: v38.2,47.75 37.45,47 37.45,45.25 32.7,40.5 32.7,37.75 35.45,37.75 36.2,38.5 JP3.4 | JP_EK-TM4C1294XL.73 102.45,46.5 103.45,47.5 103.45,53 102.45,54 EK-TM4C1294XL.74
PA1  (via drill 0.5)
  Top 0.25: v96.2,37.75 72.95,37.75 72.45,37.25 68.95,37.25 66.45,34.75 59.45,34.75 56.95,37.25 46.7,37.25 45.45,38.5 JP4.4
  Bottom 0.25: 104.7,46.25 104.95,46.5 JP_EK-TM4C1294XL.75 104.7,46.25 | 104.7,46.25 v96.2,37.75 | 104.7,46.25 104.7,46.5 103.95,47.25 103.95,52.75 104.95,53.75 EK-TM4C1294XL.76
PA2  (via drill 0.5)
  Top 0.25: v51.2,34.25 50.95,34 21.95,34 16.45,39.5 16.45,46.25 16.2,46.25 JP_EK-TM4C1294XL.5
  Bottom 0.25: v51.2,34.25 52.7,35.75 52.7,37.25 53.95,38.5 JP5.4 | EK-TM4C1294XL.6 16.2,53.75 17.2,52.75 17.2,48.5 16.45,47.75 16.45,47 16.2,46.75 16.2,46.5 JP_EK-TM4C1294XL.5
PA3
  Top 0.25: JP6.4 62.95,38.5 62.2,37.75 51.2,37.75 48.7,40.25 45.45,40.25 43.7,38.5 43.7,37.75 41.95,37.75 39.45,40.25 26.7,40.25 24.2,37.75 20.7,37.75 18.95,39.5 18.95,46.25 18.7,46.25 JP_EK-TM4C1294XL.7
  Bottom 0.25: EK-TM4C1294XL.8 18.7,53.75 19.7,52.75 19.7,47.5 18.7,46.5 JP_EK-TM4C1294XL.7
PA4
  Bottom 0.25: 21.2,46.25 21.2,38.75 JP1.2 | 21.2,46.25 22.2,47.25 22.2,52.75 21.2,53.75 EK-TM4C1294XL.10 | 21.2,46.25 JP_EK-TM4C1294XL.9
PA5
  Bottom 0.25: 23.7,46.25 23.7,46 25.95,43.75 25.95,40.25 27.45,38.75 JP2.2 | 23.7,46.25 24.7,47.25 24.7,52.75 23.7,53.75 EK-TM4C1294XL.12 | 23.7,46.25 JP_EK-TM4C1294XL.11
PA6  (via drill 0.5)
  Top 0.25: v47.45,41 v66.95,41 | JP_EK-TM4C1294XL.26 EK-TM4C1294XL.25
  Bottom 0.25: v66.95,41 69.2,38.75 JP7.2 | v47.45,41 45.2,43.25 42.45,43.25 42.45,47.5 41.45,48.5 JP_EK-TM4C1294XL.26
PA7  (via drill 0.5)
  Top 0.25: v75.95,55 74.7,56.25 47.2,56.25 45.2,54.25 45.2,53.75 43.7,52.25 43.7,51.5 43.95,51.5 EK-TM4C1294XL.27
  Bottom 0.25: v75.95,55 75.95,44.75 80.2,44.75 81.45,43.5 81.45,41.75 78.45,38.75 JP8.2 | JP_EK-TM4C1294XL.28 43.95,49 43.95,51.25 EK-TM4C1294XL.27
PB0
  Bottom 0.25: JP_EK-TM4C1294XL.57 82.2,46.5 83.2,47.5 83.2,52.75 82.2,53.75 EK-TM4C1294XL.58
PB1
  Top 0.25: JP_EK-TM4C1294XL.59 84.45,46.5 83.2,47.75 83.2,53 83.7,53 84.45,53.75 EK-TM4C1294XL.60
PB2
  Top 0.25: JP_EK-TM4C1294XL.68 94.95,49 94.95,51.25 EK-TM4C1294XL.67
PB3
  Top 0.25: JP_EK-TM4C1294XL.70 97.45,49 97.45,51.25 EK-TM4C1294XL.69
PB4
  Top 0.25: JP_EK-TM4C1294XL.6 16.2,49 16.2,51.25 EK-TM4C1294XL.5
PB5
  Top 0.25: JP_EK-TM4C1294XL.8 18.7,49 18.7,51.25 EK-TM4C1294XL.7
PC4
  Top 0.25: JP_EK-TM4C1294XL.24 38.95,49 38.95,51.25 EK-TM4C1294XL.23
PC5
  Top 0.25: JP_EK-TM4C1294XL.22 36.45,49 36.45,51.25 EK-TM4C1294XL.21
PC6
  Top 0.25: JP_EK-TM4C1294XL.20 33.95,49 33.95,51.25 EK-TM4C1294XL.19
PC7
  Top 0.25: JP_EK-TM4C1294XL.18 31.45,49 31.45,51.25 EK-TM4C1294XL.17
PD0  (via drill 0.5)
  Top 0.25: v38.45,43.25 44.95,43.25 47.95,46.25 47.95,55.75 69.95,55.75 71.7,54 EK-TM4C1294XL.50
  Bottom 0.25: v38.45,43.25 33.95,38.75 JP3.2 | JP_EK-TM4C1294XL.49 71.95,46.5 72.95,47.5 72.95,53 71.95,54 EK-TM4C1294XL.50
PD1  (via drill 0.5)
  Top 0.25: v65.95,41.75 45.95,41.75 42.95,38.75 JP4.2
  Bottom 0.25: v65.95,41.75 66.95,42.75 69.2,42.75 69.2,46.25 JP_EK-TM4C1294XL.47 69.45,46.25 70.45,47.25 70.45,52.75 69.45,53.75 EK-TM4C1294XL.48
PD2  (via drill 0.5)
  Top 0.25: v68.7,40.25 53.2,40.25 51.7,38.75 JP5.2
  Bottom 0.25: v68.7,40.25 74.45,46 74.45,46.25 | 74.45,46.25 73.45,47.25 73.45,52.75 74.45,53.75 EK-TM4C1294XL.52 | 74.45,46.25 JP_EK-TM4C1294XL.51
PD3
  Bottom 0.25: JP6.2 60.7,38.75 66.7,44.75 66.7,46.25 JP_EK-TM4C1294XL.45 66.95,46.5 67.95,47.5 67.95,52.75 66.95,53.75 EK-TM4C1294XL.46
PD4
  Top 0.25: JP7.6 74.45,38.75 73.2,40 72.7,40 71.45,41.25 71.45,42.75 68.2,42.75 66.45,44.5 61.2,44.5 59.45,46.25 JP_EK-TM4C1294XL.39
  Bottom 0.25: EK-TM4C1294XL.40 59.2,53.75 58.2,52.75 58.2,47.25 59.2,46.25 JP_EK-TM4C1294XL.39
PD5  (via drill 0.5)
  Top 0.25: v68.45,43.5 68.7,43.25 78.7,43.25 83.2,38.75 JP8.6 | v66.2,43.25 65.95,43.5 59.7,43.5 56.95,46.25 56.7,46.25 JP_EK-TM4C1294XL.37
  Bottom 0.25: v68.45,43.5 66.2,43.5 v66.2,43.25 | EK-TM4C1294XL.38 56.7,53.75 57.7,52.75 57.7,47.25 56.7,46.25 JP_EK-TM4C1294XL.37
PD6
  Bottom 0.25: JP_EK-TM4C1294XL.43 64.2,46.5 63.2,47.5 63.2,52.75 64.2,53.75 EK-TM4C1294XL.44
PD7
  Bottom 0.25: JP_EK-TM4C1294XL.41 61.7,46.5 60.7,47.5 60.7,53 61.7,54 EK-TM4C1294XL.42
PE0
  Bottom 0.25: JP_EK-TM4C1294XL.13 26.2,46.5 25.2,47.5 25.2,53 26.2,54 EK-TM4C1294XL.14
PE1
  Bottom 0.25: JP_EK-TM4C1294XL.15 28.7,46.5 27.2,48 27.2,52.25 28.7,53.75 EK-TM4C1294XL.16
PE2
  Bottom 0.25: JP_EK-TM4C1294XL.17 31.45,46.5 32.45,47.5 32.45,52.75 31.45,53.75 EK-TM4C1294XL.18
PE3
  Bottom 0.25: JP_EK-TM4C1294XL.19 33.95,46.5 34.95,47.5 34.95,51.75 33.95,52.75 33.95,53.75 EK-TM4C1294XL.20
PE4
  Bottom 0.25: JP_EK-TM4C1294XL.21 36.45,46.5 37.45,47.5 37.45,52.75 36.45,53.75 EK-TM4C1294XL.22
PE5
  Bottom 0.25: JP_EK-TM4C1294XL.23 38.95,46.5 39.95,47.5 39.95,53 38.95,54 EK-TM4C1294XL.24
PF0
  Bottom 0.25: JP_EK-TM4C1294XL.65 92.2,46.5 91.2,47.5 91.2,53 92.2,54 EK-TM4C1294XL.66
PF1
  Bottom 0.25: JP_EK-TM4C1294XL.67 94.95,46.5 95.95,47.5 95.95,52.75 94.95,53.75 EK-TM4C1294XL.68
PF2
  Bottom 0.25: JP_EK-TM4C1294XL.69 97.45,46.5 98.45,47.5 98.45,51.75 97.45,52.75 97.45,53.75 EK-TM4C1294XL.70
PF3
  Bottom 0.25: JP_EK-TM4C1294XL.71 99.95,46.5 100.95,47.5 100.95,52.75 99.95,53.75 EK-TM4C1294XL.72
PF4
  Bottom 0.25: JP_EK-TM4C1294XL.63 89.95,46.5 90.7,47.25 90.7,53 89.95,53.75 EK-TM4C1294XL.64
PG0
  Top 0.25: JP_EK-TM4C1294XL.32 49.2,49 49.2,51.25 EK-TM4C1294XL.31
PG1
  Top 0.25: JP_EK-TM4C1294XL.30 46.45,49 46.45,51.25 EK-TM4C1294XL.29
PH0
  Top 0.25: JP_EK-TM4C1294XL.10 21.2,49 21.2,51.25 EK-TM4C1294XL.9
PH1
  Top 0.25: JP_EK-TM4C1294XL.12 23.7,49 23.7,51.25 EK-TM4C1294XL.11
PH2
  Top 0.25: JP_EK-TM4C1294XL.14 26.2,49 26.2,51.25 EK-TM4C1294XL.13
PH3
  Top 0.25: JP_EK-TM4C1294XL.16 28.7,49 28.7,51.25 EK-TM4C1294XL.15
PJ0
  Bottom 0.25: JP_EK-TM4C1294XL.81 112.45,46.5 111.45,47.5 111.45,51.75 112.45,52.75 112.45,53.75 EK-TM4C1294XL.82
PJ1
  Bottom 0.25: JP_EK-TM4C1294XL.83 114.95,46.5 113.95,47.5 113.95,52.75 114.95,53.75 EK-TM4C1294XL.84
PK0
  Bottom 0.25: 41.45,46.25 41.45,45 37.45,41 37.45,37.25 35.95,37.25 35.45,36.75 35.45,36.5 30.45,31.5 30.45,29.5 23.7,29.5 22.95,30.25 21.2,30.25 JP9.2 | 41.45,46.25 40.45,47.25 40.45,52.75 41.45,53.75 EK-TM4C1294XL.26 | 41.45,46.25 JP_EK-TM4C1294XL.25
PK1  (via drill 0.5)
  Top 0.25: v25.2,41.25 27.95,44 v43.2,44
  Bottom 0.25: v25.2,41.25 25.2,30.75 24.95,30.5 JP10.2 | v43.2,44 43.95,44.75 43.95,46.25 | 43.95,46.25 42.95,47.25 42.95,52.75 43.95,53.75 EK-TM4C1294XL.28 | 43.95,46.25 JP_EK-TM4C1294XL.27
PK2  (via drill 0.5)
  Top 0.25: v35.95,44.75 44.95,44.75 46.45,46.25 JP_EK-TM4C1294XL.29
  Bottom 0.25: v35.95,44.75 32.2,41 32.2,33.75 28.95,30.5 JP11.2 | EK-TM4C1294XL.30 46.45,53.75 45.45,52.75 45.45,47.5 46.45,46.5 JP_EK-TM4C1294XL.29
PK3
  Bottom 0.25: JP12.2 32.7,30.5 37.45,35.25 37.45,36.75 37.95,37.25 37.95,39.25 38.95,40.25 48.95,40.25 48.95,46.25 JP_EK-TM4C1294XL.31 48.95,46.5 48.95,47.5 47.95,48.5 47.95,52.75 48.95,53.75 EK-TM4C1294XL.32
PK4
  Top 0.25: JP_EK-TM4C1294XL.78 107.45,49 107.45,51.25 EK-TM4C1294XL.77
PK5
  Top 0.25: EK-TM4C1294XL.75 JP_EK-TM4C1294XL.76
PK6
  Top 0.25: JP_EK-TM4C1294XL.64 89.7,49 89.7,51.25 EK-TM4C1294XL.63
PK7
  Top 0.25: JP_EK-TM4C1294XL.60 84.7,49 84.7,51.25 EK-TM4C1294XL.59
PL0
  Top 0.25: JP_EK-TM4C1294XL.44 64.45,49 64.45,51.25 EK-TM4C1294XL.43
PL1
  Top 0.25: JP_EK-TM4C1294XL.46 66.95,49 66.95,51.25 EK-TM4C1294XL.45
PL2
  Top 0.25: JP_EK-TM4C1294XL.48 69.45,49 69.45,51.25 EK-TM4C1294XL.47
PL3
  Top 0.25: JP_EK-TM4C1294XL.50 71.95,49 71.95,51.25 EK-TM4C1294XL.49
PL4  (via drill 0.5)
  Top 0.25: v77.7,44 88.95,44 90.7,45.75 90.7,48 91.45,48 92.2,48.75 JP_EK-TM4C1294XL.66 92.2,49 92.2,51.25 EK-TM4C1294XL.65
  Bottom 0.25: v77.7,44 72.95,39.25 72.95,37.25 65.2,37.25 64.45,36.5 64.45,33.5 43.95,33.5 38.95,38.5 JP3.6
PL5
  Top 0.25: JP_EK-TM4C1294XL.80 109.95,49 109.95,51.25 EK-TM4C1294XL.79
  Bottom 0.25: JP4.6 47.95,38.75 53.7,44.5 54.7,44.5 55.7,45.5 55.7,54.5 56.95,55.75 111.2,55.75 111.2,52.5 110.2,51.5 EK-TM4C1294XL.79
PM0  (via drill 0.5)
  Top 0.25: v58.7,42.5 46.2,42.5 45.45,41.75 26.7,41.75 23.7,38.75 JP1.4 | EK-TM4C1294XL.41 61.7,51.25 61.7,49 JP_EK-TM4C1294XL.42
  Bottom 0.25: v58.7,42.5 60.95,44.75 63.2,44.75 63.2,47 61.95,48.25 61.95,48.75 JP_EK-TM4C1294XL.42
PM1  (via drill 0.5)
  Top 0.25: v48.45,34.75 33.95,34.75 30.2,38.5 JP2.4 | EK-TM4C1294XL.39 59.2,51.25 59.2,49 JP_EK-TM4C1294XL.40
  Bottom 0.25: v48.45,34.75 49.95,36.25 49.95,39.25 55.45,44.75 60.45,44.75 60.45,46.5 59.2,47.75 59.2,48.75 JP_EK-TM4C1294XL.40
PM2
  Top 0.25: JP7.4 71.7,38.75 70.2,40.25 70.2,41.25 69.2,41.25 66.45,44 59.95,44 58.2,45.75 58.2,48 57.45,48 56.7,48.75 JP_EK-TM4C1294XL.38 56.7,49 56.7,51.25 EK-TM4C1294XL.37
PM3  (via drill 0.5)
  Top 0.25: v72.95,40.75 78.7,40.75 80.7,38.75 JP8.4 | v70.95,40.75 70.95,41.5 70.45,41.5 69.95,42 v69.45,42 | v67.2,42 66.7,42.5 59.7,42.5 57.7,44.5 54.2,44.5 52.7,46 52.7,48 52.45,48 51.7,48.75 JP_EK-TM4C1294XL.34 51.7,49 51.7,51.25 EK-TM4C1294XL.33
  Bottom 0.25: v70.95,40.75 v72.95,40.75 | v67.2,42 v69.45,42
PM4  (via drill 0.5)
  Top 0.25: v51.95,30.5 47.95,30.5 JP16.2 | v54.95,30.5 57.95,33.5 v66.95,33.5 | v68.45,35 68.7,34.75 113.7,34.75 125.2,46.25 JP_EK-TM4C1294XL.91
  Bottom 0.25: v54.95,30.5 v51.95,30.5 | v68.45,35 v66.95,33.5 | EK-TM4C1294XL.92 125.2,53.75 124.2,52.75 124.2,47.25 125.2,46.25 JP_EK-TM4C1294XL.91
PM5  (via drill 0.5)
  Top 0.25: v71.45,33.5 62.95,25 55.7,25 55.7,26.5 53.2,29 46.2,29 45.2,30 44.45,30 44.2,30.25 JP15.2 | v80.7,43.25 80.95,43.5 119.2,43.5 121.95,46.25 122.7,46.25 JP_EK-TM4C1294XL.89
  Bottom 0.25: v71.45,33.5 73.45,35.5 73.45,36.5 74.7,37.75 76.7,37.75 76.7,39.25 v80.7,43.25 | EK-TM4C1294XL.90 122.7,53.75 121.7,52.75 121.7,47.25 122.7,46.25 JP_EK-TM4C1294XL.89
PM6  (via drill 0.5)
  Top 0.25: v68.2,32.75 v65.7,32.75 | v70.95,35.5 71.2,35.25 111.95,35.25 v120.2,43.5
  Bottom 0.25: v65.7,32.75 44.2,32.75 39.7,37.25 38.45,37.25 37.95,36.75 37.95,32.5 39.95,30.5 JP14.2 | v70.95,35.5 v68.2,32.75 | 120.2,46.25 v120.2,43.5 | 120.2,46.25 121.2,47.25 121.2,52.75 120.2,53.75 EK-TM4C1294XL.88 | 120.2,46.25 JP_EK-TM4C1294XL.87
PM7  (via drill 0.5)
  Top 0.25: v72.2,32 62.7,22.5 53.7,22.5 51.45,24.75 46.2,24.75 46.2,28 44.7,29.5 38.2,29.5 37.95,29.75 36.95,29.75 36.45,30.25 JP13.2 | v74.95,32 75.45,32.5 98.2,32.5 v98.45,32.25
  Bottom 0.25: v74.95,32 v72.2,32 | v98.45,32.25 110.95,44.75 117.45,44.75 117.45,46.25 JP_EK-TM4C1294XL.85 117.7,46.25 118.7,47.25 118.7,52.75 117.7,53.75 EK-TM4C1294XL.86
PN0
  Top 0.25: JP_EK-TM4C1294XL.86 117.7,49 117.7,51.25 EK-TM4C1294XL.85
PN1
  Top 0.25: JP_EK-TM4C1294XL.88 120.2,49 120.2,51.25 EK-TM4C1294XL.87
PN2
  Top 0.25: JP_EK-TM4C1294XL.90 122.7,49 122.7,51.25 EK-TM4C1294XL.89
PN3
  Top 0.25: JP_EK-TM4C1294XL.92 125.2,49 125.2,51.25 EK-TM4C1294XL.91
PN4
  Top 0.25: JP_EK-TM4C1294XL.82 112.7,49 112.7,51.25 EK-TM4C1294XL.81
PN5
  Top 0.25: JP_EK-TM4C1294XL.84 115.2,49 115.2,51.25 EK-TM4C1294XL.83
PP0
  Top 0.25: JP_EK-TM4C1294XL.53 76.95,46.5 75.95,47.5 75.95,53.25 76.45,53.25 76.95,53.75 EK-TM4C1294XL.54
PP1
  Bottom 0.25: JP_EK-TM4C1294XL.55 79.45,46.5 78.45,47.5 78.45,52.75 79.45,53.75 EK-TM4C1294XL.56
PP2
  Top 0.25: JP_EK-TM4C1294XL.72 99.95,49 99.95,51.25 EK-TM4C1294XL.71
PP3
  Top 0.25: JP_EK-TM4C1294XL.74 102.45,49 102.45,51.25 EK-TM4C1294XL.73
PP4
  Bottom 0.25: JP_EK-TM4C1294XL.77 107.45,46.5 106.45,47.5 106.45,53 107.45,54 EK-TM4C1294XL.78
PP5
  Bottom 0.25: JP_EK-TM4C1294XL.79 109.95,46.5 108.95,47.5 108.95,52.75 109.95,53.75 EK-TM4C1294XL.80
PQ0
  Top 0.25: JP_EK-TM4C1294XL.52 74.45,49 74.45,51.25 EK-TM4C1294XL.51
PQ1
  Top 0.25: JP_EK-TM4C1294XL.54 76.95,49 76.95,51.25 EK-TM4C1294XL.53
PQ2
  Top 0.25: JP_EK-TM4C1294XL.56 79.7,49 79.7,51.25 EK-TM4C1294XL.55
PQ3
  Top 0.25: JP_EK-TM4C1294XL.58 82.2,49 82.2,51.25 EK-TM4C1294XL.57
PQ4
  Top 0.25: JP_EK-TM4C1294XL.94 127.95,49 127.95,51.25 EK-TM4C1294XL.93
RESET
  Bottom 0.25: JP_EK-TM4C1294XL.93 127.7,46.5 126.7,47.5 126.7,52.75 127.7,53.75 EK-TM4C1294XL.94
SUP_D0D3
  Top 0.25: U$4.8 21.95,12.75 22.95,12.75 U$4.7 23.2,12.75 24.2,12.75 U$4.6 24.45,12.75 25.45,12.75 U$4.5 25.7,12.75 28.7,12.75 U$3.8 28.95,12.75 29.95,12.75 U$3.7 30.2,12.75 31.2,12.75 U$3.6 31.45,12.75 32.45,12.75 U$3.5 32.7,12.75 35.7,12.75 U$2.8 35.95,12.75 36.95,12.75 U$2.7 37.2,12.75 38.2,12.75 U$2.6 38.45,12.75 39.45,12.75 U$2.5 39.7,12.75 42.7,12.75 U$1.8 42.95,12.75 43.95,12.75 U$1.7 44.2,12.75 45.2,12.75 U$1.6 45.45,12.75 46.45,12.75 U$1.5 46.7,12.5 54.7,12.5 | JP17.7 54.7,7 54.7,9.5 JP17.5 54.7,9.75 54.7,12 JP17.3 | 54.7,12.5 54.7,14.5 JP17.1 | 54.7,12.5 54.7,12.25 JP17.3 | 54.7,12.5 JP17.3
SUP_D4D7
  Top 0.25: U$5.5 21.95,16.75 22.95,16.75 U$5.6 23.2,16.75 24.2,16.75 U$5.7 24.45,16.75 25.45,16.75 U$5.8 25.7,16.75 28.7,16.75 U$6.5 28.95,16.75 29.95,16.75 U$6.6 30.2,16.75 31.2,16.75 U$6.7 31.45,16.75 32.45,16.75 U$6.8 32.7,16.75 35.7,16.75 U$7.5 35.95,16.75 36.95,16.75 U$7.6 37.2,16.75 38.2,16.75 U$7.7 38.45,16.75 39.45,16.75 U$7.8 39.7,16.75 42.7,16.75 U$8.5 42.95,16.75 43.95,16.75 U$8.6 44.2,16.75 45.2,16.75 U$8.7 45.45,16.75 46.45,16.75 U$8.8 46.7,16.75 53.2,16.75 54.7,18.25 JP18.7 | JP18.1 54.7,26 54.7,23.5 JP18.3
  Bottom 0.25: JP18.7 54.7,18.5 54.7,20.75 JP18.5 54.7,21 54.7,23.25 JP18.3
SUP_EXT1
  Top 0.25: X1.10 11.45,11 18.95,3.5 44.45,3.5 45.45,4.5 54.95,4.5 57.2,6.75 JP17.8
SUP_EXT2  (via drill 0.5)
  Top 0.25: v16.7,27.25 16.45,27.25 14.2,29.5 11.45,29.5 X1.18 | v18.2,19.75 19.2,18.75 53.7,18.75 54.45,19.5 56.2,19.5 57.2,18.5 JP18.8
  Bottom 0.25: v16.7,27.25 18.2,25.75 v18.2,19.75
T0CCP0  (via drill 0.5)
  Top 0.25: JP3.1 33.95,36.25 36.2,36.25 JP3.3 36.45,36.25 38.7,36.25 JP3.5 | D7.3 68.95,9.25 71.7,9.25 R24.1 71.95,9.25 72.2,9.25 72.2,12 R20.2 72.2,12.25 71.45,12.25 v70.95,12.75 | v71.7,15.25 71.7,16.25 SJ1.2 71.7,16.5 67.7,16.5 62.2,22 53.7,22 v53.45,21.75
  Bottom 0.25: v71.7,15.25 70.95,14.5 v70.95,12.75 | v53.45,21.75 50.95,24.25 50.95,32 42.95,32 38.95,36 JP3.5
T0CCP1  (via drill 0.5)
  Top 0.25: JP4.1 42.95,36.25 45.2,36.25 JP4.3 45.45,36.25 47.7,36.25 JP4.5 47.95,36 48.45,35.5 50.95,35.5 52.2,34.25 78.95,34.25 v79.45,33.75 | D1.3 85.2,27.5 82.2,27.5 R6.1 81.95,27.5 81.7,27.5 81.7,25 R2.2 81.95,24.75 82.45,24.75 v82.95,24.25 | v83.45,20.75 82.45,20.75 82.2,20.5 SJ2.2
  Bottom 0.25: v83.45,20.75 82.95,21.25 v82.95,24.25 82.95,30.25 v79.45,33.75
T1CCP0  (via drill 0.5)
  Top 0.25: JP5.1 51.7,36.25 53.95,36.25 JP5.3 54.2,36.25 56.45,36.25 JP5.5 | SJ3.2 124.45,20.5 124.45,24.75 R8.2 124.45,25 124.45,27.5 R12.1 124.7,27.5 127.7,27.5 D3.3 127.95,27.5 134.7,27.5 134.7,33.25 134.2,33.75 v97.45,33.75 | v65.2,45.25 65.45,45 66.45,45 66.7,44.75 v86.45,44.75
  Bottom 0.25: v65.2,45.25 65.2,44.75 56.7,36.25 JP5.5 | v97.45,33.75 v86.45,44.75
T1CCP1  (via drill 0.5)
  Top 0.25: JP6.1 60.7,36.25 62.95,36.25 JP6.3 63.2,36.25 65.45,36.25 JP6.5 | SJ4.2 113.95,16.25 113.95,12.25 R14.2 114.2,12 114.2,9.25 113.95,9.25 R18.1 113.7,9.25 110.7,9.25 D5.3 110.45,9.5 88.2,9.5 v83.2,14.5 | v75.2,30.5 77.2,30.5 77.7,31 v79.45,31
  Bottom 0.25: v75.2,30.5 75.2,31 68.45,31 66.2,33.25 66.2,35.5 65.7,36 JP6.5 | v79.45,31 79.2,30.75 79.2,18.75 83.2,14.75 v83.2,14.5
T2CCP0  (via drill 0.5)
  Top 0.25: JP1.1 21.2,36.25 23.45,36.25 JP1.3 | v54.7,2.25 55.95,3.5 97.95,3.5 98.95,4.5 v115.7,4.5
  Bottom 0.25: SJ5.2 119.95,15 119.95,12.25 R26.2 119.95,12 120.2,11.75 120.2,9.25 | 120.2,9.25 123.2,9.25 D9.3 | 120.2,9.25 120.2,8.75 R30.1 119.95,8.5 119.95,8.25 119.2,7.5 119.2,6.75 118.7,6.25 118.7,5.75 116.7,5.75 116.45,6 115.95,6 115.45,5.5 115.45,4.75 v115.7,4.5 | v54.7,2.25 32.95,2.25 18.95,16.25 18.95,34 20.95,36 JP1.1
T2CCP1
  Top 0.25: JP2.1 27.7,36.25 29.95,36.25 JP2.3
  Bottom 0.25: D11.3 131.7,37.5 129.45,37.5 SJ6.2 | 129.2,34 132.45,34 132.45,34.25 R36.1 | 129.2,34 129.2,37.25 SJ6.2 | 129.2,34 R32.2 | JP2.3 30.2,36.25 31.45,37.5 31.45,44 30.2,45.25 30.2,54.25 32.2,56.25 119.2,56.25 119.2,43.5 123.7,39 129.2,39 129.2,37.5 SJ6.2
T3CCP0
  Top 0.25: JP7.1 69.45,36.25 71.7,36.25 JP7.3 71.95,36.25 74.45,36.25 JP7.5
  Bottom 0.25: D13.3 69.95,17.25 69.95,20.25 R42.1 69.95,20.5 69.95,20.75 72.45,20.75 R38.2 72.7,20.5 75.45,20.5 SJ7.2 75.7,20.5 75.7,20.75 78.2,23.25 78.2,32.5 74.7,36 JP7.5
T3CCP1
  Top 0.25: JP8.1 78.45,36.25 80.7,36.25 JP8.3 80.95,36.25 83.2,36.25 JP8.5
  Bottom 0.25: 95.2,9.25 94.45,8.5 94.45,5 99.95,5 100.95,6 100.95,9.25 98.7,9.25 D15.3 | 95.2,9.25 95.2,12 R44.2 95.2,12.25 95.2,15 | 95.2,9.25 R48.1 | 95.2,15 95.2,15.5 SJ8.2 | 95.2,15 93.7,16.5 93.7,25.75 83.45,36 JP8.5
VREF
  Bottom 0.25: JP_EK-TM4C1294XL.33 51.45,46.5 50.45,47.5 50.45,52.75 51.45,53.75 EK-TM4C1294XL.34
WAKE
  Top 0.25: JP_EK-TM4C1294XL.96 130.45,49 130.45,51.25 EK-TM4C1294XL.95

## Text on the board
tNames: +3V3 | +5V | +12V | EXT2 | +3V3 | +5V | +12V | EXT1 | Entwickelt von Tim Schaake | Modulares Messsystem - Modul Frequenz | Vers. 1.0